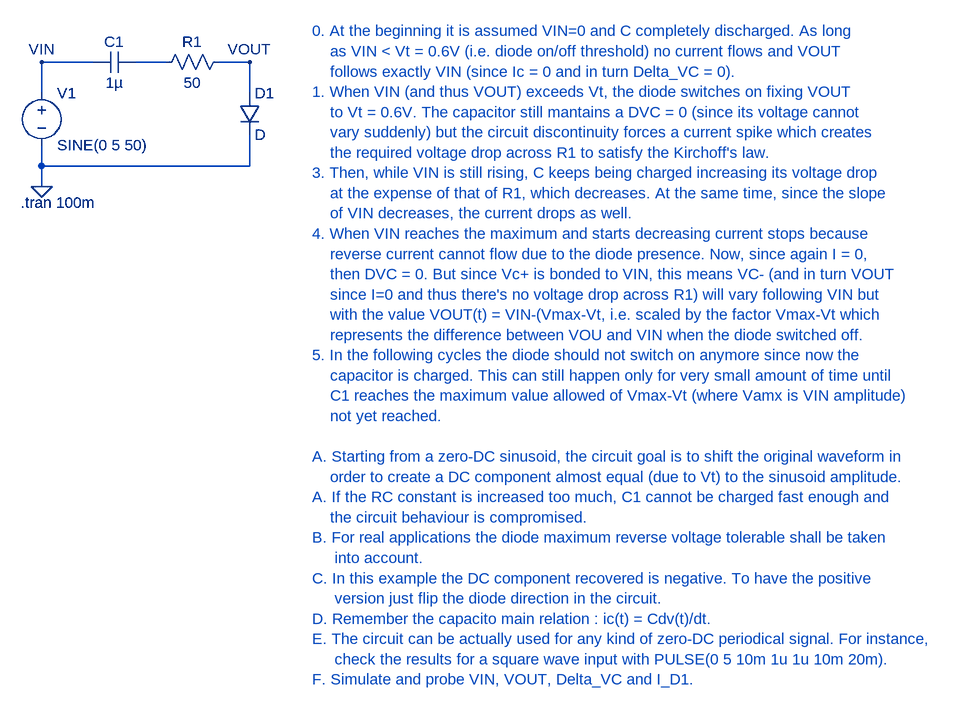
[diagram p0: schematic DC_Restorer.asc]
DC_Restorer.asc, the LTspice schematic file:
Version 4
SHEET 1 2084 972
WIRE 160 80 80 80
WIRE 272 80 224 80
WIRE 400 80 352 80
WIRE 80 128 80 80
WIRE 400 128 400 80
WIRE 80 240 80 208
WIRE 400 240 400 192
WIRE 400 240 80 240
WIRE 80 272 80 240
FLAG 80 272 0
FLAG 80 80 VIN
FLAG 400 80 VOUT
SYMBOL voltage 80 112 R0
WINDOW 123 0 0 Left 0
WINDOW 39 0 0 Left 0
SYMATTR InstName V1
SYMATTR Value SINE(0 5 50)
SYMBOL cap 224 64 R90
WINDOW 0 0 32 VBottom 2
WINDOW 3 32 32 VTop 2
SYMATTR InstName C1
SYMATTR Value 1µ
SYMBOL res 368 64 R90
WINDOW 0 0 56 VBottom 2
WINDOW 3 32 56 VTop 2
SYMATTR InstName R1
SYMATTR Value 50
SYMBOL diode 384 128 R0
SYMATTR InstName D1
TEXT 48 296 Left 2 !.tran 100m
TEXT 496 32 Left 2 ;0. At the beginning it is assumed VIN=0 and C completely discharged. As long\n    as VIN < Vt = 0.6V (i.e. diode on/off threshold) no current flows and VOUT\n    follows exactly VIN (since Ic = 0 and in turn Delta_VC = 0).\n1. When VIN (and thus VOUT) exceeds Vt, the diode switches on fixing VOUT\n    to Vt = 0.6V. The capacitor still mantains a DVC = 0 (since its voltage cannot\n    vary suddenly) but the circuit discontinuity forces a current spike which creates\n    the required voltage drop across R1 to satisfy the Kirchoff's law.\n3. Then, while VIN is still rising, C keeps being charged increasing its voltage drop\n    at the expense of that of R1, which decreases. At the same time, since the slope\n    of VIN decreases, the current drops as well.\n4. When VIN reaches the maximum and starts decreasing current stops because\n    reverse current cannot flow due to the diode presence. Now, since again I = 0,\n    then DVC = 0. But since Vc+ is bonded to VIN, this means VC- (and in turn VOUT\n    since I=0 and thus there's no voltage drop across R1) will vary following VIN but\n    with the value VOUT(t) = VIN-(Vmax-Vt, i.e. scaled by the factor Vmax-Vt which\n    represents the difference between VOU and VIN when the diode switched off.\n5. In the following cycles the diode should not switch on anymore since now the\n    capacitor is charged. This can still happen only for very small amount of time until\n    C1 reaches the maximum value allowed of Vmax-Vt (where Vamx is VIN amplitude)\n    not yet reached.\n \nA. Starting from a zero-DC sinusoid, the circuit goal is to shift the original waveform in\n    order to create a DC component almost equal (due to Vt) to the sinusoid amplitude.\nA. If the RC constant is increased too much, C1 cannot be charged fast enough and\n    the circuit behaviour is compromised.\nB. For real applications the diode maximum reverse voltage tolerable shall be taken\n     into account.\nC. In this example the DC component recovered is negative. To have the positive\n     version just flip the diode direction in the circuit.\nD. Remember the capacito main relation : ic(t) = Cdv(t)/dt.\nE. The circuit can be actually used for any kind of zero-DC periodical signal. For instance,\n     check the results for a square wave input with PULSE(0 5 10m 1u 1u 10m 20m).\nF. Simulate and probe VIN, VOUT, Delta_VC and I_D1.

The netlist it stands for:
* DC_Restorer.asc
V1 VIN 0 SINE(0 5 50)
C1 N001 VIN 1µ
R1 VOUT N001 50
D1 VOUT 0 D
.model D D
.lib standard.dio
.tran 100m
* 0. At the beginning it is assumed VIN=0 and C completely discharged. As long
*     as VIN < Vt = 0.6V (i.e. diode on/off threshold) no current flows and VOUT
*     follows exactly VIN (since Ic = 0 and in turn Delta_VC = 0).
* 1. When VIN (and thus VOUT) exceeds Vt, the diode switches on fixing VOUT
*     to Vt = 0.6V. The capacitor still mantains a DVC = 0 (since its voltage cannot
*     vary suddenly) but the circuit discontinuity forces a current spike which creates
*     the required voltage drop across R1 to satisfy the Kirchoff's law.
* 3. Then, while VIN is still rising, C keeps being charged increasing its voltage drop
*     at the expense of that of R1, which decreases. At the same time, since the slope
*     of VIN decreases, the current drops as well.
* 4. When VIN reaches the maximum and starts decreasing current stops because
*     reverse current cannot flow due to the diode presence. Now, since again I = 0,
*     then DVC = 0. But since Vc+ is bonded to VIN, this means VC- (and in turn VOUT
*     since I=0 and thus there's no voltage drop across R1) will vary following VIN but
*     with the value VOUT(t) = VIN-(Vmax-Vt, i.e. scaled by the factor Vmax-Vt which
*     represents the difference between VOU and VIN when the diode switched off.
* 5. In the following cycles the diode should not switch on anymore since now the
*     capacitor is charged. This can still happen only for very small amount of time until
*     C1 reaches the maximum value allowed of Vmax-Vt (where Vamx is VIN amplitude)
*     not yet reached.
* A. Starting from a zero-DC sinusoid, the circuit goal is to shift the original waveform in
*     order to create a DC component almost equal (due to Vt) to the sinusoid amplitude.
* A. If the RC constant is increased too much, C1 cannot be charged fast enough and
*     the circuit behaviour is compromised.
* B. For real applications the diode maximum reverse voltage tolerable shall be taken
*      into account.
* C. In this example the DC component recovered is negative. To have the positive
*      version just flip the diode direction in the circuit.
* D. Remember the capacito main relation : ic(t) = Cdv(t)/dt.
* E. The circuit can be actually used for any kind of zero-DC periodical signal. For instance,
*      check the results for a square wave input with PULSE(0 5 10m 1u 1u 10m 20m).
* F. Simulate and probe VIN, VOUT, Delta_VC and I_D1.
.backanno
.end